# Altium project ValenFanController.PrjPCB
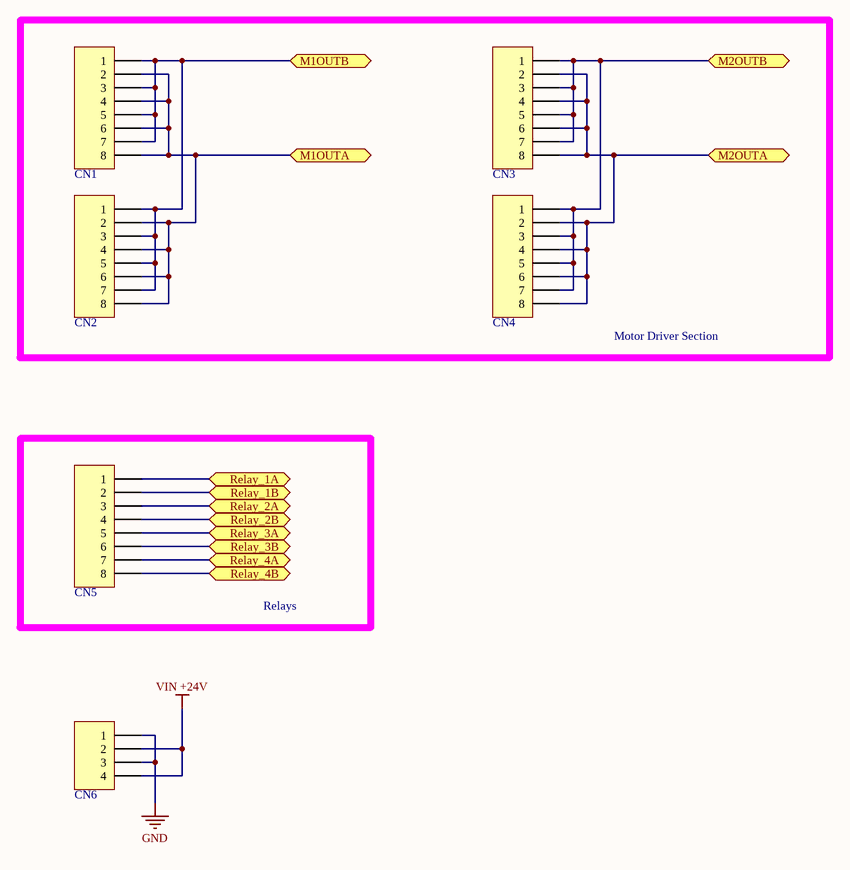
[diagram p0: Connectors.SchDoc]
7 sheets, 103 parts. Net scope: flat (ports and power ports of the same name join across sheets).
Board files: ValenFanControllerv02.PcbDoc, ValenFanControllerPanel.PcbDoc
Sheets:
  Connectors.SchDoc
  IO.SchDoc
  Main.SchDoc
  POWER.SchDoc
  Sensor.SchDoc
  USART.SchDoc
  MotorController.SchDoc

## Sheet Connectors.SchDoc
size A

### Parts
CN1  Connector 4973-08TRNLF  [Connector 4973-08TRNLF]  (value not drawn)
CN2  Connector 4973-08TRNLF  [Connector 4973-08TRNLF]  (value not drawn)
CN3  Connector 4973-08TRNLF  [Connector 4973-08TRNLF]  (value not drawn)
CN4  Connector 4973-08TRNLF  [Connector 4973-08TRNLF]  (value not drawn)
CN5  Connector 4973-08TRNLF  [Connector 4973-08TRNLF]  (value not drawn)
CN6  Connector 4973-04TRNLF  [Connector 4973-04TRNLF]  (value not drawn)

### Blocks framed on the sheet
Motor Driver Section: CN1-CN4
Relays: CN5

### Ports
M1OUTA, M1OUTB, M2OUTA, M2OUTB, Relay_1A (bidir), Relay_1B (bidir), Relay_2A (bidir), Relay_2B (bidir), Relay_3A (bidir), Relay_3B (bidir), Relay_4A (bidir), Relay_4B (bidir)

### Nets
GND: CN6.1 CN6.3
VIN +24V: CN6.2 CN6.4
NetCN1_1: CN1.1 CN1.3 CN1.5 CN1.7 CN2.1 CN2.3 CN2.5 CN2.7 ; port M1OUTB
NetCN1_2: CN1.2 CN1.4 CN1.6 CN1.8 CN2.2 CN2.4 CN2.6 CN2.8 ; port M1OUTA
NetCN3_1: CN3.1 CN3.3 CN3.5 CN3.7 CN4.1 CN4.3 CN4.5 CN4.7 ; port M2OUTB
NetCN3_2: CN3.2 CN3.4 CN3.6 CN3.8 CN4.2 CN4.4 CN4.6 CN4.8 ; port M2OUTA
NetCN5_1: CN5.1 ; port Relay_1A
NetCN5_2: CN5.2 ; port Relay_1B
NetCN5_3: CN5.3 ; port Relay_2A
NetCN5_4: CN5.4 ; port Relay_2B
NetCN5_5: CN5.5 ; port Relay_3A
NetCN5_6: CN5.6 ; port Relay_3B
NetCN5_7: CN5.7 ; port Relay_4A
NetCN5_8: CN5.8 ; port Relay_4B

### Library data of the parts
CN1-CN5 = Connector 4973-08TRNLF: Connector 8-Pin, 90 degree, 3.5mm
CN6 = Connector 4973-04TRNLF: Connector 4-Pin, 90 degree, 3.5mm

## Sheet IO.SchDoc
size C
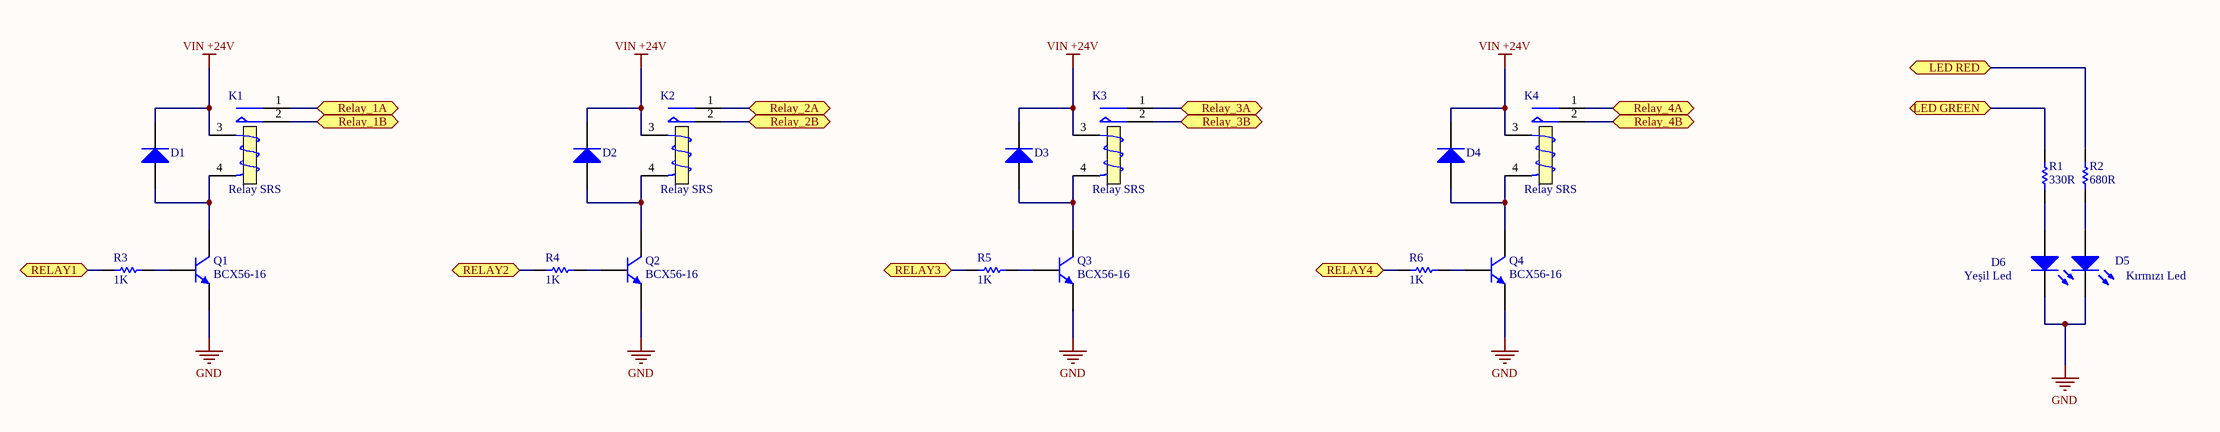
[diagram p1: IO.SchDoc]

### Parts
D1  Diode 1N4007  [DO214]  (value not drawn)
D2  Diode 1N4007  [DO214]  (value not drawn)
D3  Diode 1N4007  [DO214]  (value not drawn)
D4  Diode 1N4007  [DO214]  (value not drawn)
D5  Yeşil Led  [6-0805 - LED]
D6  Kırmızı Led  [6-0805 - LED]
K1  Relay SRS  [RELAY ALQ324]
K2  Relay SRS  [RELAY ALQ324]
K3  Relay SRS  [RELAY ALQ324]
K4  Relay SRS  [RELAY ALQ324]
Q1  BCX56-16  [SOT89M]
Q2  BCX56-16  [SOT89M]
Q3  BCX56-16  [SOT89M]
Q4  BCX56-16  [SOT89M]
R1  value 330R  [6-0805 - big]  (hidden comment: Res1)
R2  value 680R  [6-0805 - big]  (hidden comment: Res1)
R3  value 1K  [6-0805]  (hidden comment: Res1)
R4  value 1K  [6-0805]  (hidden comment: Res1)
R5  value 1K  [6-0805]  (hidden comment: Res1)
R6  value 1K  [6-0805]  (hidden comment: Res1)

### Ports
LED GREEN (bidir), LED RED (bidir), RELAY1 (bidir), RELAY2 (bidir), RELAY3 (bidir), RELAY4 (bidir), Relay_1A (bidir), Relay_1B (bidir), Relay_2A (bidir), Relay_2B (bidir), Relay_3A (bidir), Relay_3B (bidir), Relay_4A (bidir), Relay_4B (bidir)

### Nets
GND: D5.2(K) D6.2(K) Q1.3(E) Q2.3(E) Q3.3(E) Q4.3(E)
VIN +24V: D1.2(K) D2.2(K) D3.2(K) D4.2(K) K1.3(T1) K2.3(T1) K3.3(T1) K4.3(T1)
NetCN5_1: K1.1(COM) ; port Relay_1A
NetCN5_2: K1.2(NC) ; port Relay_1B
NetCN5_3: K2.1(COM) ; port Relay_2A
NetCN5_4: K2.2(NC) ; port Relay_2B
NetCN5_5: K3.1(COM) ; port Relay_3A
NetCN5_6: K3.2(NC) ; port Relay_3B
NetCN5_7: K4.1(COM) ; port Relay_4A
NetCN5_8: K4.2(NC) ; port Relay_4B
NetD1_1: D1.1(A) K1.4(T2) Q1.2(C)
NetD2_1: D2.1(A) K2.4(T2) Q2.2(C)
NetD3_1: D3.1(A) K3.4(T2) Q3.2(C)
NetD4_1: D4.1(A) K4.4(T2) Q4.2(C)
NetD5_1: D5.1(A) R2.1
NetD6_1: D6.1(A) R1.1
NetQ1_1: Q1.1(B) R3.2
NetQ2_1: Q2.1(B) R4.2
NetQ3_1: Q3.1(B) R5.2
NetQ4_1: Q4.1(B) R6.2
NetR1_2: R1.2 ; port LED GREEN
NetR2_2: R2.2 ; port LED RED
NetR3_1: R3.1 ; port RELAY1
NetR4_1: R4.1 ; port RELAY2
NetR5_1: R5.1 ; port RELAY3
NetR6_1: R6.1 ; port RELAY4

### Library data of the parts
D1-D4 = Diode 1N4007: 1 Amp General Purpose Rectifier; Published: 8-Jun-2000; LatestRevisionDate: 17-Jul-2002; LatestRevisionNote: Re-released for DXP Platform.; DatasheetDocument: 1998; PackageDocument: Aug-1999; PackageReference: DO-41; Publisher: Altium Limited; Code_JEDEC: DO-204-AL; ComponentLink1Description: Manufacturer Link; ComponentLink1URL: http://www.fairchildsemi.com/; ComponentLink2Description: Datasheet; ComponentLink2URL: http://www.fairchildsemi.com/ds/1N%2F1N4001.pdf
D5 D6 = LED: Typical INFRARED GaAs LED; Published: 8-Jun-2000; LatestRevisionDate: 08-Jul-2005; LatestRevisionNote: Mech Layer 1 removed.; PackageReference: LED-0; Publisher: Altium Limited
K1-K4 = Relay ALQ324: Published: 8-Jun-2000; Revision: July-2002: Re-released for DXP Platform.; Publisher: Altium Limited
Q1-Q4 = BCX56-16: NPN General-purpose Transistor; Published: 17-Sep-2003; LatestRevisionDate: 12-Dec-2006; LatestRevisionNote: IPC-7351 Footprint Added.; DatasheetVersion: Jun-1999; PackageVersion: May-1999; PackageReference: SOT23; Publisher: Altium Limited; PackageDescription: 3-Pin SOT-23 Package 0.95 mm Pitch, 2.3 mm Lead Span; ComponentLink1Description: Manufacturer Link; ComponentLink1URL: http://www.semiconductors.philips.com/; ComponentLink2Description: Datasheet; ComponentLink2URL: http://www.semiconductors.philips.com/acrobat/datasheets/BC817_BC817W_BC337_5.pdf
R1-R6 = Res1: Resistor; Published: 8-Jun-2000; LatestRevisionDate: 17-Jul-2002; LatestRevisionNote: Re-released for DXP Platform.; PackageReference: AXIAL-0.3; Publisher: Altium Limited

## Sheet Main.SchDoc
size A4
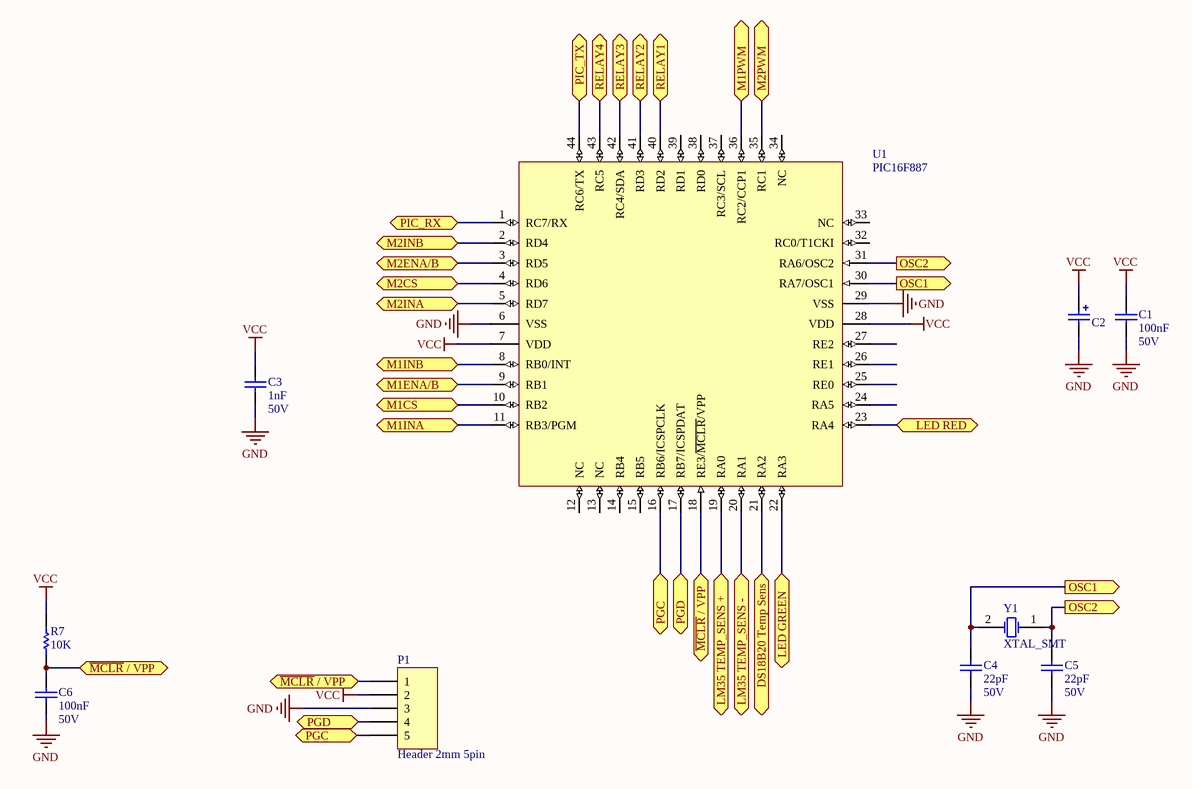
[diagram p2: Main.SchDoc]

### Parts
C1  value 100nF  Voltage: 50V  [3-0603_L]  (hidden comment: Cap)
C2  CAP-Tantal  [3528]  (value not drawn)
C3  value 1nF  Voltage: 50V  [3-0603_L]  (hidden comment: Cap)
C4  value 22pF  Voltage: 50V  [3-0603_L]  (hidden comment: Cap)
C5  value 22pF  Voltage: 50V  [3-0603_L]  (hidden comment: Cap)
C6  value 100nF  Voltage: 50V  [3-0603_L]  (hidden comment: Cap)
P1  Header 2mm 5pin  [Header 2mm 5Pin]
R7  value 10K  [3-0603_L]  (hidden comment: Res1)
U1  PIC16F887  [TQFP-44]
Y1  XTAL_SMT  [XTAL - SMT]

### Ports
DS18B20 Temp Sens (bidir), LED GREEN (bidir), LED RED (bidir), LM35 TEMP_SENS + (bidir), LM35 TEMP_SENS - (bidir), M1CS, M1ENA/B, M1INA, M1INB, M1PWM, M2CS, M2ENA/B, M2INA, M2INB, M2PWM, OSC1 (out), OSC2 (out), PGC (bidir), PGD (bidir), PIC_RX (bidir), PIC_TX (bidir), RELAY1 (bidir), RELAY2 (bidir), RELAY3 (bidir), RELAY4 (bidir), ~{MCLR} / VPP (bidir)

### Nets
GND: C1.1 C2.2 C3.1 C4.1 C5.1 C6.1 P1.3 U1.6(VSS) U1.29(VSS)
VCC: C1.2 C2.1 C3.2 P1.2 R7.2 U1.7(VDD) U1.28(VDD)
NetC4_2: C4.2 U1.30(RA7/OSC1) Y1.2(OSC2) ; port OSC1
NetC5_2: C5.2 U1.31(RA6/OSC2) Y1.1(OSC1) ; port OSC2
NetC6_2: C6.2 P1.1 R7.1 U1.18(RE3/~{MCLR}/VPP) ; port ~{MCLR} / VPP
NetC15_2: U1.10(RB2) ; port M1CS
NetC16_2: U1.4(RD6) ; port M2CS
NetD16_1: U1.20(RA1) ; port LM35 TEMP_SENS -
NetP1_4: P1.4 U1.17(RB7/ICSPDAT) ; port PGD
NetP1_5: P1.5 U1.16(RB6/ICSPCLK) ; port PGC
NetP2_2: U1.19(RA0) ; port LM35 TEMP_SENS +
NetR1_2: U1.22(RA3) ; port LED GREEN
NetR2_2: U1.23(RA4) ; port LED RED
NetR3_1: U1.40(RD2) ; port RELAY1
NetR4_1: U1.41(RD3) ; port RELAY2
NetR5_1: U1.42(RC4/SDA) ; port RELAY3
NetR6_1: U1.43(RC5) ; port RELAY4
NetR11_1: U1.9(RB1) ; port M1ENA/B
NetR12_1: U1.3(RD5) ; port M2ENA/B
NetR13_1: U1.11(RB3/PGM) ; port M1INA
NetR14_1: U1.5(RD7) ; port M2INA
NetR15_1: U1.8(RB0/INT) ; port M1INB
NetR16_1: U1.2(RD4) ; port M2INB
NetR17_1: U1.36(RC2/CCP1) ; port M1PWM
NetR18_1: U1.35(RC1) ; port M2PWM
NetR30_1: U1.21(RA2) ; port DS18B20 Temp Sens
NetU1_1: U1.1(RC7/RX) ; port PIC_RX
NetU1_44: U1.44(RC6/TX) ; port PIC_TX

Not connected (* = marked no-connect by the designer): U1 12(NC) 13(NC) 14(RB4) 15(RB5) 24(RA5) 25(RE0) 26(RE1) 27(RE2) 32(RC0/T1CKI) 33(NC) 34(NC) 37(RC3/SCL) 38(RD0) 39(RD1)

### Library data of the parts
C1 C3-C6 = Cap: Capacitor; Published: 8-Jun-2000; Revision: July-2002: Re-released for DXP Platform.; Publisher: Altium Limited
C2 = CAP-Tantal: Tantamount Military, Surface Mount MIL-PRF-55365/8 Qualified Solid Tantalum Chip Capacitor: 6.8uF, 20% Tolerance, 6 WVDC @ +85°C, Surge = 8V; Note: See Data Sheet for full range of components; Value: 22uF; Voltage: 10V; Published: 19-Mar-2004; DatasheetDocument: 20-Mar-2003; PackageReference: 3528; Publisher: Altium Limited; Code_JEITA: 3528; ComponentLink1Description: Manufacturer Link; ComponentLink1URL: http://www.vishay.com/; ComponentLink2Description: Datasheet; ComponentLink2URL: http://www.vishay.com/docs/40011/cwr11.pdf
P1 = Header 2mm 5pin: Header 2mm , 5-Pin; LatestRevisionDate: 17-Jul-2002; LatestRevisionNote: Re-released for DXP Platform.; Publisher: Altium Limited
R7 = Res1: Resistor; Published: 8-Jun-2000; LatestRevisionDate: 17-Jul-2002; LatestRevisionNote: Re-released for DXP Platform.; PackageReference: AXIAL-0.3; Publisher: Altium Limited
U1 = PIC16F887: EPROM-Based 8-Bit CMOS Microcontroller; Package Information: Latest Revision: 1998; Published: 8-Jun-2000; Revision: 17-Jul-2002: Re-released for DXP Platform.; Datasheet: Latest Revision: 1998; Package Reference: JW18; Publisher: Altium Limited
Y1 = XTAL_SMT: Crystal Oscillator; Value: 20MHz; Published: 8-Jun-2000; LatestRevisionDate: 17-Jul-2002; LatestRevisionNote: Re-released for DXP Platform.; PackageReference: R38; Publisher: Altium Limited

## Sheet POWER.SchDoc
size A4
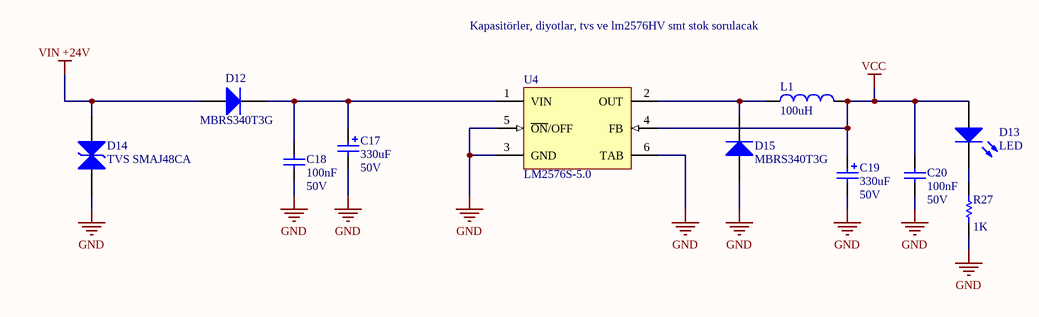
[diagram p3: POWER.SchDoc]

### Parts
C17  value 330uF  Voltage: 50V  [CAP Size H13= 12.5x13.8mm]  (hidden comment: Cap Pol1)
C18  value 100nF  Voltage: 50V  [3-0603_L]  (hidden comment: Cap)
C19  value 330uF  Voltage: 50V  [CAP Size H13= 12.5x13.8mm]  (hidden comment: Cap Pol1)
C20  value 100nF  Voltage: 50V  [3-0603_L]  (hidden comment: Cap)
D12  MBRS340T3G  [CASE 403-03 ISSUE E]
D13  LED  [6-0805 - LED]
D14  TVS SMAJ48CA  [DO214 AA]
D15  MBRS340T3G  [CASE 403-03 ISSUE E]
L1  value 100uH  [EB-221M18G01]  (hidden comment: Inductor)
R27  value 1K  [6-0805_M]  (hidden comment: Res1)
U4  LM2576S-5.0  [TS5B_M]

### Nets
GND: C17.2 C18.1 C19.2 C20.1 D14.1 D15.1(A) R27.1 U4.3(GND) U4.5(~{ON}/OFF) U4.6(TAB)
VCC: C19.1 C20.2 D13.1(A) L1.2 U4.4(FB)
VIN +24V: D12.1(A) D14.2
NetC17_1: C17.1 C18.2 D12.2(K) U4.1(VIN)
NetD13_2: D13.2(K) R27.2
NetD15_2: D15.2(K) L1.1 U4.2(OUT)

### Notes on the sheet
- Kapasitörler, diyotlar, tvs ve lm2576HV smt stok sorulacak

### Library data of the parts
C17 C19 = Cap Pol1: Polarized Capacitor (Radial); Published: 8-Jun-2000; Revision: July-2002: Re-released for DXP Platform.; Publisher: Altium Limited
C18 C20 = Cap: Capacitor; Published: 8-Jun-2000; Revision: July-2002: Re-released for DXP Platform.; Publisher: Altium Limited
D12 D15 = MBRS340T3G: 3 Amp Shotky Rectifier; Published: 8-Jun-2000; LatestRevisionDate: 17-Jul-2002; LatestRevisionNote: Re-released for DXP Platform.; DatasheetDocument: 1998; PackageDocument: Aug-1999; Publisher: Altium Limited; ComponentLink1Description: Manufacturer Link; ComponentLink2Description: Datasheet
D13 = LED: Typical INFRARED GaAs LED; Published: 8-Jun-2000; LatestRevisionDate: 08-Jul-2005; LatestRevisionNote: Mech Layer 1 removed.; PackageReference: LED-0; Publisher: Altium Limited
L1 = Inductor: Code_IEC: 1005; Published: 8-Jun-2000; LatestRevisionDate: 17-Jul-2002; LatestRevisionNote: Re-released for DXP Platform.; PackageReference: 0402-A; Publisher: Altium Limited; Code_JEITA: 0402
R27 = Res1: Resistor; Published: 8-Jun-2000; LatestRevisionDate: 17-Jul-2002; LatestRevisionNote: Re-released for DXP Platform.; PackageReference: AXIAL-0.3; Publisher: Altium Limited
U4 = LM2576S-5.0: SIMPLE SWITCHER; 3A Step-Down Voltage Regulator; Manufacturer: National Semiconductor; PackageTopMarking: NSUZXYTT*LM2576S*-5.0 P+; Published: 4-Dec-2008; PackageVersion: revD, Apr-2005; PackageReference: TS5B; Publisher: Altium Limited; PackageDescription: TO-263, Molded, .400 x .390 x .180in, 5 Lead, .067in Pitch, Surface Mount; CompType: Switcher; PartNumber: LM2576S-5.0; RoHS: O; PinCount: 5; DigiKeyPartNumber: LM2576S-5.0-ND; Code_JEDEC: MO-169-AB; ComponentLink1Description: LM2576 Datasheet; ComponentLink1URL: http://www.national.com/ds/LM/LM2576.pdf; ComponentLink2Description: LM2576 Web Page; ComponentLink2URL: http://www.national.com/pf/LM/LM2576.html; ComponentLink3Description: TS5B Package Page; ComponentLink3URL: http://www.national.com/packaging/folders/ts5b.html
D14 = TVS SMAJ48CA: Published: 8-Jun-2000; LatestRevisionDate: 17-Jul-2002; LatestRevisionNote: Re-released for DXP Platform.; DatasheetDocument: 1998; PackageDocument: Aug-1999; PackageReference: DO-41; Publisher: Altium Limited; Code_JEDEC: DO-204-AL; ComponentLink1Description: Manufacturer Link; ComponentLink1URL: http://www.fairchildsemi.com/; ComponentLink2Description: Datasheet; ComponentLink2URL: http://www.fairchildsemi.com/ds/1N%2F1N4001.pdf

## Sheet Sensor.SchDoc
size A4
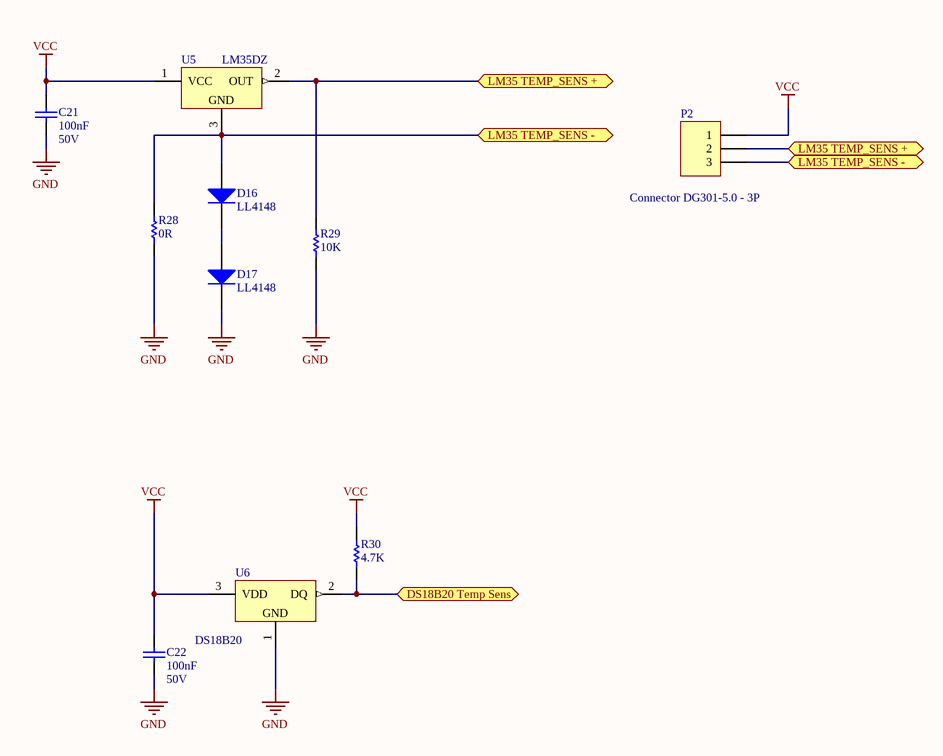
[diagram p4: Sensor.SchDoc]

### Parts
C21  value 100nF  Voltage: 50V  [3-0603_L]  (hidden comment: Cap)
C22  value 100nF  Voltage: 50V  [3-0603_L]  (hidden comment: Cap)
D16  LL4148  [DL-35 - S]
D17  LL4148  [DL-35 - S]
P2  Connector DG301-5.0 - 3P  [Connector DG301-5.0 - 3P]
R28  value 0R  [8-1206]  (hidden comment: Res1)
R29  value 10K  [3-0603_L]  (hidden comment: Res1)
R30  value 4.7K  [3-0603_L]  (hidden comment: Res1)
U5  LM35DZ  [TO-92 Big]
U6  DS18B20  [TO-92 Big]

### Ports
DS18B20 Temp Sens (bidir), LM35 TEMP_SENS + (bidir), LM35 TEMP_SENS - (bidir)

### Nets
GND: C21.1 C22.1 D17.2(K) R28.1 R29.1 U6.1(GND)
VCC: C21.2 C22.2 P2.1 R30.2 U5.1(VCC) U6.3(VDD)
NetD16_1: D16.1(A) P2.3 R28.2 U5.3(GND) ; port LM35 TEMP_SENS -
NetD16_2: D16.2(K) D17.1(A)
NetP2_2: P2.2 R29.2 U5.2(OUT) ; port LM35 TEMP_SENS +
NetR30_1: R30.1 U6.2(DQ) ; port DS18B20 Temp Sens

### Library data of the parts
C21 C22 = Cap: Capacitor; Published: 8-Jun-2000; Revision: July-2002: Re-released for DXP Platform.; Publisher: Altium Limited
D16 D17 = LL4148: 1 Amp General Purpose Rectifier; Published: 8-Jun-2000; LatestRevisionDate: 17-Jul-2002; LatestRevisionNote: Re-released for DXP Platform.; DatasheetDocument: 1998; PackageDocument: Aug-1999; Publisher: Altium Limited; Code_JEDEC: DO-204-AL; ComponentLink1Description: Manufacturer Link; ComponentLink1URL: http://www.fairchildsemi.com/; ComponentLink2Description: Datasheet; ComponentLink2URL: http://www.fairchildsemi.com/ds/1N%2F1N4001.pdf
P2 = Connector DG301-5.0 - 3P: Connector, 3-Pin; LatestRevisionDate: 17-Jul-2002; LatestRevisionNote: Re-released for DXP Platform.; Publisher: Altium Limited
R28-R30 = Res1: Resistor; Published: 8-Jun-2000; LatestRevisionDate: 17-Jul-2002; LatestRevisionNote: Re-released for DXP Platform.; PackageReference: AXIAL-0.3; Publisher: Altium Limited
U5 = LM35DZ: Temperature Sensor; Published: 24-Aug-2001; LatestRevisionDate: 06-Jun-2005; LatestRevisionNote: PCB pads lengthened.; DatasheetVersion: Mar-1997; PackageVersion: Jun-2004; PackageReference: TO-252; Publisher: Altium Limited; PackageDescription: D-PAK/TO-252-AA; 3 Leads (1 Cropped); Body 10.1 (inc. leads) x 6.6 mm (LxW max); ComponentLink1Description: Manufacturer Link; ComponentLink1URL: http://www.st.com/; ComponentLink2Description: Datasheet; ComponentLink2URL: http://www.st.com/stonline/products/literature/ds/2147/l78m05ab.pdf
U6 = DS18B20: 1-Wire Temperature Sensor; Published: 24-Aug-2001; LatestRevisionDate: 06-Jun-2005; LatestRevisionNote: PCB pads lengthened.; DatasheetVersion: Mar-1997; PackageVersion: Jun-2004; PackageReference: TO-252; Publisher: Altium Limited; PackageDescription: D-PAK/TO-252-AA; 3 Leads (1 Cropped); Body 10.1 (inc. leads) x 6.6 mm (LxW max); ComponentLink1Description: Manufacturer Link; ComponentLink1URL: http://www.st.com/; ComponentLink2Description: Datasheet; ComponentLink2URL: http://www.st.com/stonline/products/literature/ds/2147/l78m05ab.pdf

## Sheet USART.SchDoc
size A4
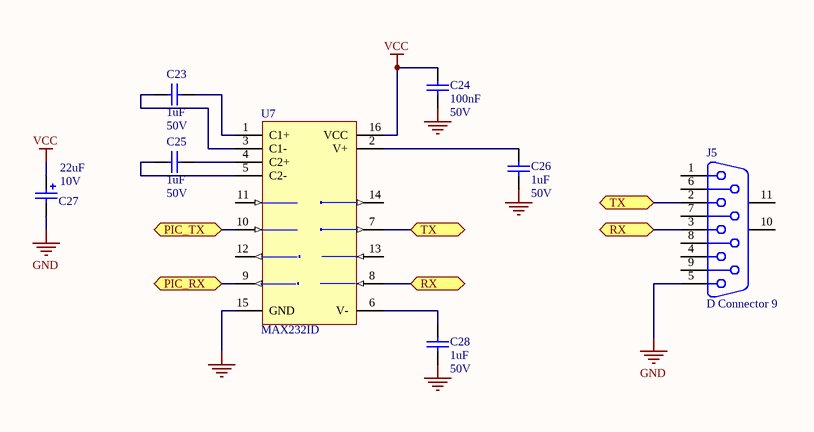
[diagram p5: USART.SchDoc]

### Parts
C23  value 1uF  Voltage: 50V  [3-0603_L]  (hidden comment: Cap)
C24  value 100nF  Voltage: 50V  [3-0603_L]  (hidden comment: Cap)
C25  value 1uF  Voltage: 50V  [3-0603_L]  (hidden comment: Cap)
C26  value 1uF  Voltage: 50V  [3-0603_L]  (hidden comment: Cap)
C27  value 22uF  Voltage: 10V  [3528]  (hidden comment: CAP-Tantal)
C28  value 1uF  Voltage: 50V  [3-0603_L]  (hidden comment: Cap)
J5  D Connector 9  [DSUB1.385-2H9]
U7  MAX232ID  [SOIC16 - big]

### Ports
PIC_RX (bidir), PIC_TX (bidir), RX (bidir), TX (bidir)

### Nets
GND: C24.1 C26.2 C27.2 C28.2 J5.5 U7.15(GND)
VCC: C24.2 C27.1 U7.16(VCC)
NetC23_1: C23.1 U7.1(C1+)
NetC23_2: C23.2 U7.3(C1-)
NetC25_1: C25.1 U7.4(C2+)
NetC25_2: C25.2 U7.5(C2-)
NetC26_1: C26.1 U7.2(V+)
NetC28_1: C28.1 U7.6(V-)
NetJ5_2: J5.2 U7.7(T2OUT) ; port TX
NetJ5_3: J5.3 U7.8(R2IN) ; port RX
NetU1_1: U7.9(R2OUT) ; port PIC_RX
NetU1_44: U7.10(T2IN) ; port PIC_TX

Not connected (* = marked no-connect by the designer): J5 1 4 6 7 8 9 10(MH1) 11(MH2); U7 11(T1IN) 12(R1OUT) 13(R1IN) 14(T1OUT)

### Library data of the parts
C23-C26 C28 = Cap: Capacitor; Published: 8-Jun-2000; Revision: July-2002: Re-released for DXP Platform.; Publisher: Altium Limited
C27 = CAP-Tantal: Tantamount Military, Surface Mount MIL-PRF-55365/8 Qualified Solid Tantalum Chip Capacitor: 6.8uF, 20% Tolerance, 6 WVDC @ +85°C, Surge = 8V; Note: See Data Sheet for full range of components; Published: 19-Mar-2004; DatasheetDocument: 20-Mar-2003; PackageReference: 3528; Publisher: Altium Limited; Code_JEITA: 3528; ComponentLink1Description: Manufacturer Link; ComponentLink1URL: http://www.vishay.com/; ComponentLink2Description: Datasheet; ComponentLink2URL: http://www.vishay.com/docs/40011/cwr11.pdf
J5 = D Connector 9: Receptacle Assembly, 9 Position, Right Angle; PackageDocument: O; Positions: 9; Published: 15-Jun-2001; LatestRevisionDate: 17-Jul-2002; LatestRevisionNote: Re-released for DXP Platform.; DatasheetDocument: 1-Sep-1999; PackageReference: 788750; Publisher: Altium Limited; Orientation: Right Angle; Gender: Receptacle
U7 = MAX232ID: 5V, Low-Power, up to 1Mbps, True RS-232 Transceiver Using Four 0.1µF External Capacitor; Code - JEDEC: MS-012-AC; Code - IPC: SO16; Published: 16-Jan-2001; Revision: 17-Jul-2002: Re-released for DXP Platform.; Datasheet: Latest Revision: Mar-1999; Package Reference: NSO16; Publisher: Altium Limited

## Sheet MotorController.SchDoc
size A3
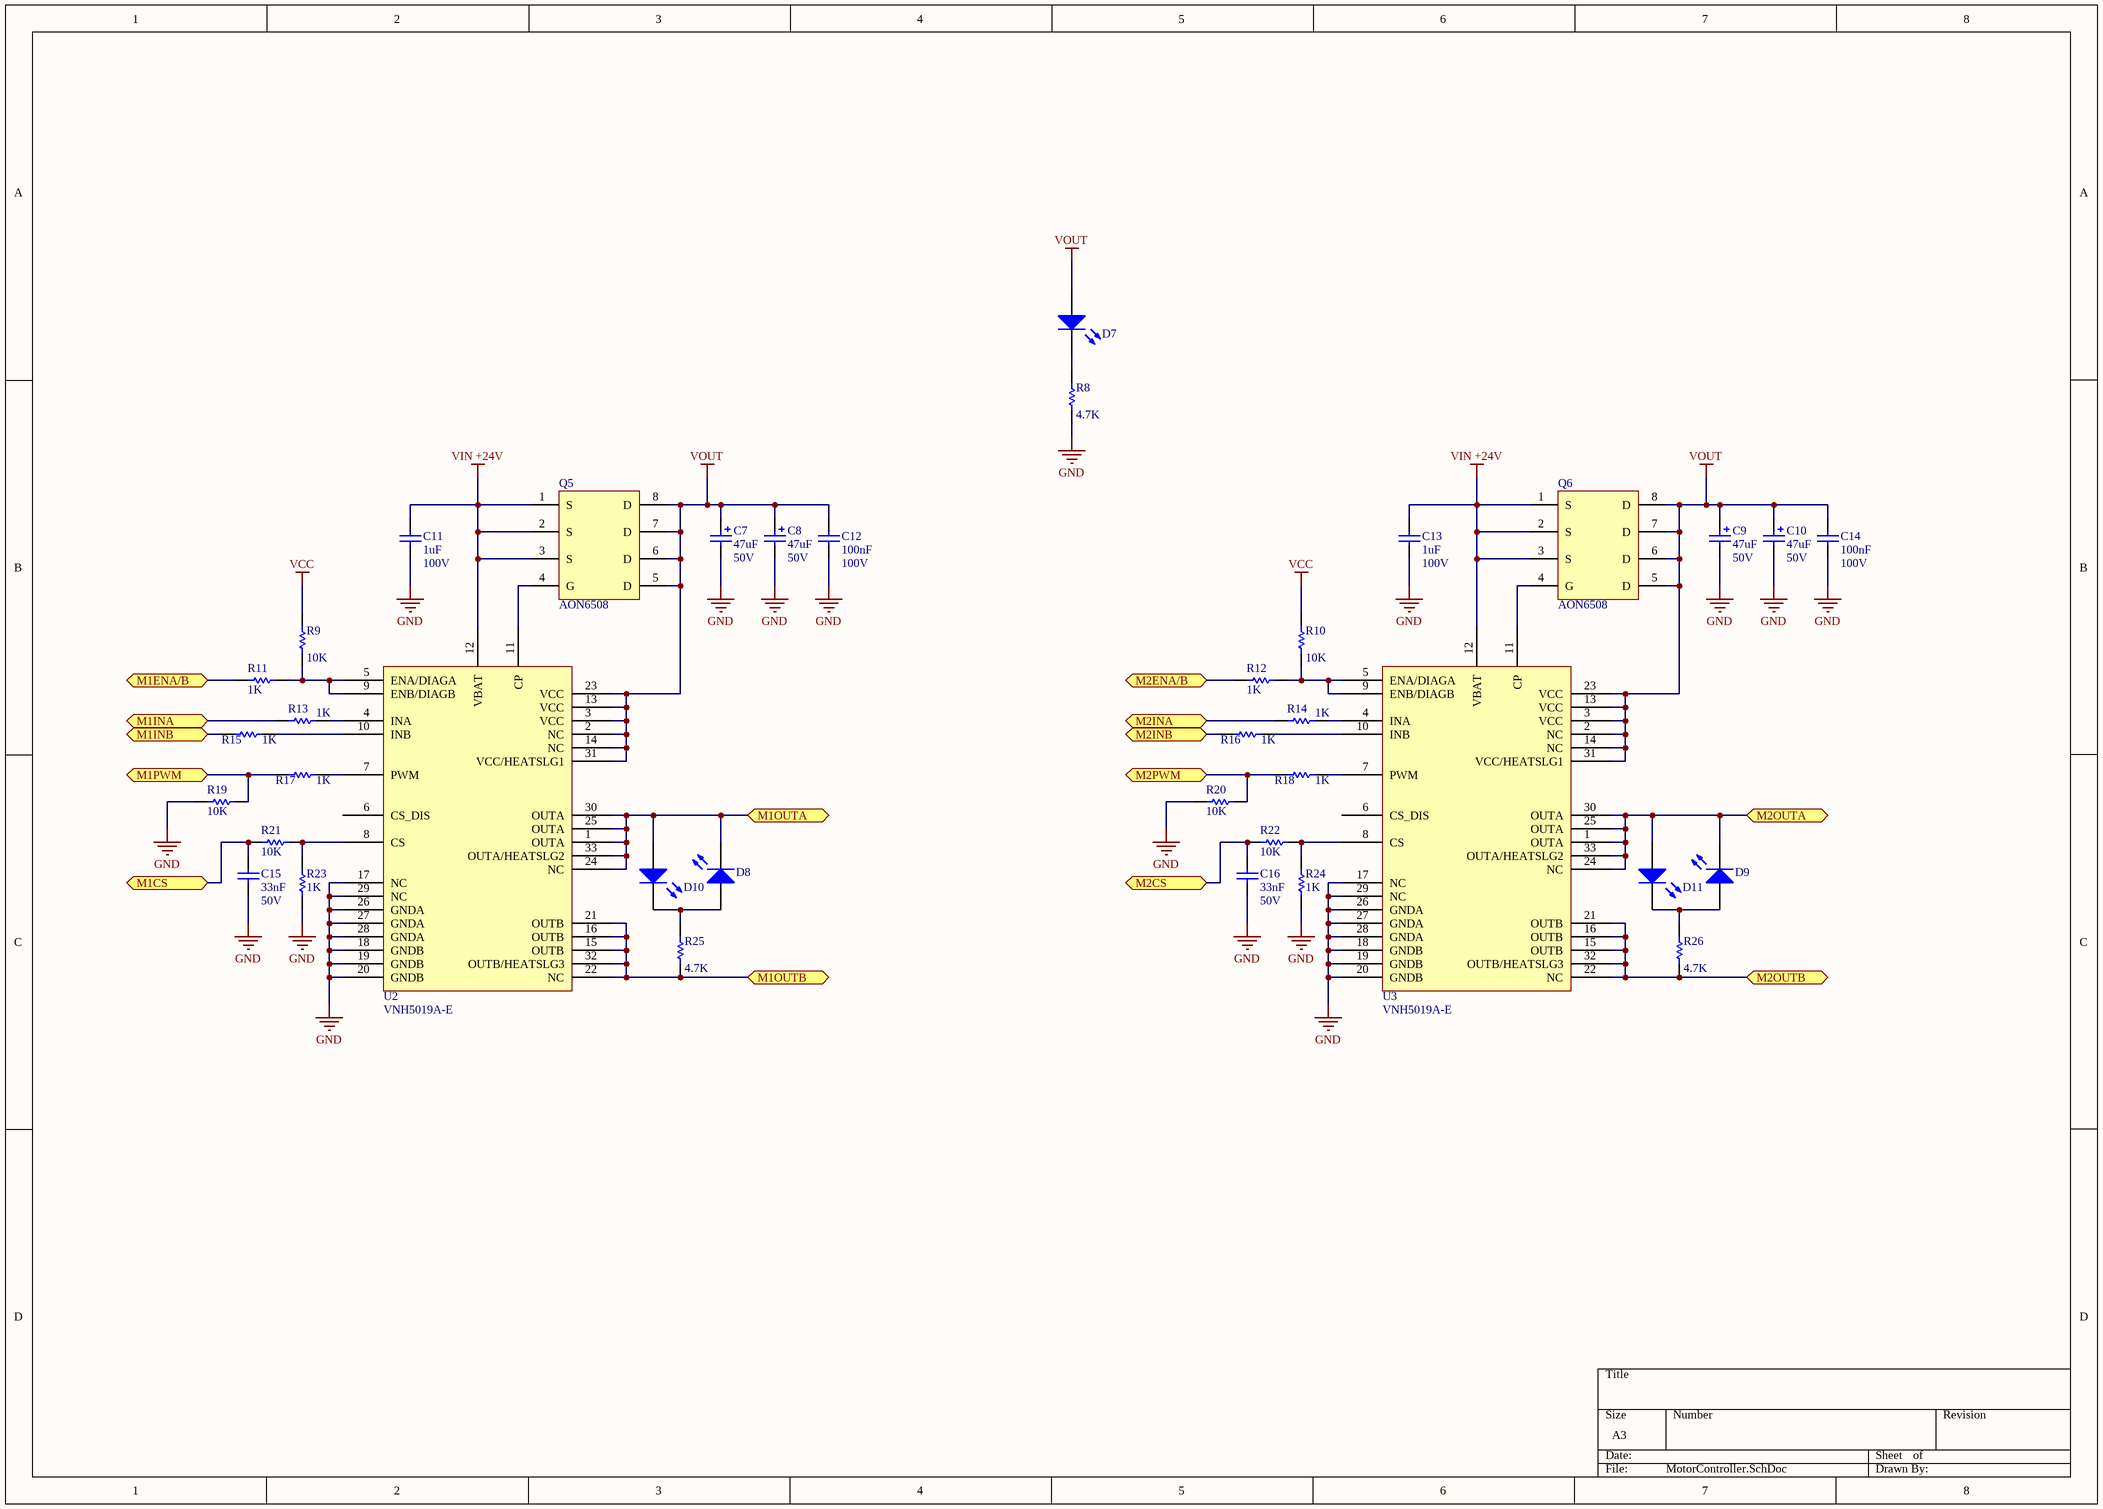
[diagram p6: MotorController.SchDoc]

### Parts
C7  value 47uF  Voltage: 50V  [CAP D Size]  (hidden comment: Cap Pol1)
C8  value 47uF  Voltage: 50V  [CAP D Size]  (hidden comment: Cap Pol1)
C9  value 47uF  Voltage: 50V  [CAP D Size]  (hidden comment: Cap Pol1)
C10  value 47uF  Voltage: 50V  [CAP D Size]  (hidden comment: Cap Pol1)
C11  value 1uF  Voltage: 100V  [8-1206]  (hidden comment: Cap)
C12  value 100nF  Voltage: 100V  [6-0805 - big]  (hidden comment: Cap)
C13  value 1uF  Voltage: 100V  [8-1206]  (hidden comment: Cap)
C14  value 100nF  Voltage: 100V  [6-0805 - big]  (hidden comment: Cap)
C15  value 33nF  Voltage: 50V  [3-0603_L]  (hidden comment: Cap)
C16  value 33nF  Voltage: 50V  [3-0603_L]  (hidden comment: Cap)
D7  LED  [6-0805 - LED]  (value not drawn)
D8  LED  [6-0805 - LED]  (value not drawn)
D9  LED  [6-0805 - LED]  (value not drawn)
D10  LED  [6-0805 - LED]  (value not drawn)
D11  LED  [6-0805 - LED]  (value not drawn)
Q5  AON6508  [DFN5x6 EP]
Q6  AON6508  [DFN5x6 EP]
R8  value 4.7K  [3-0603_L]  (hidden comment: Res1)
R9  value 10K  [3-0603_L]  (hidden comment: Res1)
R10  value 10K  [3-0603_L]  (hidden comment: Res1)
R11  value 1K  [3-0603_L]  (hidden comment: Res1)
R12  value 1K  [3-0603_L]  (hidden comment: Res1)
R13  value 1K  [3-0603_L]  (hidden comment: Res1)
R14  value 1K  [3-0603_L]  (hidden comment: Res1)
R15  value 1K  [3-0603_L]  (hidden comment: Res1)
R16  value 1K  [3-0603_L]  (hidden comment: Res1)
R17  value 1K  [3-0603_L]  (hidden comment: Res1)
R18  value 1K  [3-0603_L]  (hidden comment: Res1)
R19  value 10K  [3-0603_L]  (hidden comment: Res1)
R20  value 10K  [3-0603_L]  (hidden comment: Res1)
R21  value 10K  [3-0603_L]  (hidden comment: Res1)
R22  value 10K  [3-0603_L]  (hidden comment: Res1)
R23  value 1K  [3-0603_L]  (hidden comment: Res1)
R24  value 1K  [3-0603_L]  (hidden comment: Res1)
R25  value 4.7K  [3-0603_L]  (hidden comment: Res1)
R26  value 4.7K  [3-0603_L]  (hidden comment: Res1)
U2  VNH5019A-E  [MultiPowerSO-30]
U3  VNH5019A-E  [MultiPowerSO-30]

### Ports
M1CS, M1ENA/B, M1INA, M1INB, M1OUTA, M1OUTB, M1PWM, M2CS, M2ENA/B, M2INA, M2INB, M2OUTA, M2OUTB, M2PWM

### Nets
GND: C7.2 C8.2 C9.2 C10.2 C11.1 C12.1 C13.1 C14.1 C15.1 C16.1 R8.1 R19.1 R20.1 R23.1 R24.1 U2.17(NC) U2.18(GNDB) U2.19(GNDB) U2.20(GNDB) U2.26(GNDA) U2.27(GNDA) U2.28(GNDA) U2.29(NC) U3.17(NC) U3.18(GNDB) U3.19(GNDB) U3.20(GNDB) U3.26(GNDA) U3.27(GNDA) U3.28(GNDA) U3.29(NC)
VCC: R9.2 R10.2
VIN +24V: C11.2 C13.2 Q5.1(S) Q5.2(S) Q5.3(S) Q6.1(S) Q6.2(S) Q6.3(S) U2.12(VBAT) U3.12(VBAT)
VOUT: C7.1 C8.1 C9.1 C10.1 C12.2 C14.2 D7.1(A) Q5.5(D) Q5.6(D) Q5.7(D) Q5.8(D) Q6.5(D) Q6.6(D) Q6.7(D) Q6.8(D) U2.2(NC) U2.3(VCC) U2.13(VCC) U2.14(NC) U2.23(VCC) U2.31(VCC/HEATSLG1) U3.2(NC) U3.3(VCC) U3.13(VCC) U3.14(NC) U3.23(VCC) U3.31(VCC/HEATSLG1)
NetC15_2: C15.2 R21.2 ; port M1CS
NetC16_2: C16.2 R22.2 ; port M2CS
NetCN1_1: R25.1 U2.15(OUTB) U2.16(OUTB) U2.21(OUTB) U2.22(NC) U2.32(OUTB/HEATSLG3) ; port M1OUTB
NetCN1_2: D8.2(K) D10.1(A) U2.1(OUTA) U2.24(NC) U2.25(OUTA) U2.30(OUTA) U2.33(OUTA/HEATSLG2) ; port M1OUTA
NetCN3_1: R26.1 U3.15(OUTB) U3.16(OUTB) U3.21(OUTB) U3.22(NC) U3.32(OUTB/HEATSLG3) ; port M2OUTB
NetCN3_2: D9.2(K) D11.1(A) U3.1(OUTA) U3.24(NC) U3.25(OUTA) U3.30(OUTA) U3.33(OUTA/HEATSLG2) ; port M2OUTA
NetD7_2: D7.2(K) R8.2
NetD8_1: D8.1(A) D10.2(K) R25.2
NetD9_1: D9.1(A) D11.2(K) R26.2
NetQ5_4: Q5.4(G) U2.11(CP)
NetQ6_4: Q6.4(G) U3.11(CP)
NetR9_1: R9.1 R11.2 U2.5(ENA/DIAGA) U2.9(ENB/DIAGB)
NetR10_1: R10.1 R12.2 U3.5(ENA/DIAGA) U3.9(ENB/DIAGB)
NetR11_1: R11.1 ; port M1ENA/B
NetR12_1: R12.1 ; port M2ENA/B
NetR13_1: R13.1 ; port M1INA
NetR13_2: R13.2 U2.4(INA)
NetR14_1: R14.1 ; port M2INA
NetR14_2: R14.2 U3.4(INA)
NetR15_1: R15.1 ; port M1INB
NetR15_2: R15.2 U2.10(INB)
NetR16_1: R16.1 ; port M2INB
NetR16_2: R16.2 U3.10(INB)
NetR17_1: R17.1 R19.2 ; port M1PWM
NetR17_2: R17.2 U2.7(PWM)
NetR18_1: R18.1 R20.2 ; port M2PWM
NetR18_2: R18.2 U3.7(PWM)
NetR21_1: R21.1 R23.2 U2.8(CS)
NetR22_1: R22.1 R24.2 U3.8(CS)

Not connected (* = marked no-connect by the designer): U2 6(CS_DIS); U3 6(CS_DIS)

### Library data of the parts
C7-C10 = Cap Pol1: Polarized Capacitor (Radial); Published: 8-Jun-2000; Revision: July-2002: Re-released for DXP Platform.; Publisher: Altium Limited
C11-C16 = Cap: Capacitor; Published: 8-Jun-2000; Revision: July-2002: Re-released for DXP Platform.; Publisher: Altium Limited
D7-D11 = LED: Typical INFRARED GaAs LED; Published: 8-Jun-2000; LatestRevisionDate: 08-Jul-2005; LatestRevisionNote: Mech Layer 1 removed.; PackageReference: LED-0; Publisher: Altium Limited
Q5 Q6 = AON6508: 30V N-Channel AlphaMOS; Published: 29-Jan-2009; DatasheetVersion: revE, Mar-2007; PackageVersion: revAW, Oct-2008; Publisher: Altium Limited; ComponentLink3Description: Packaging Specification
R8-R26 = Res1: Resistor; Published: 8-Jun-2000; LatestRevisionDate: 17-Jul-2002; LatestRevisionNote: Re-released for DXP Platform.; PackageReference: AXIAL-0.3; Publisher: Altium Limited
U2 U3 = VNH5019A-E: Automotive fully integrated H-bridge motor driver; PackageVersion: revAW, Oct-2008; Publisher: Altium Limited; ComponentLink2Description: Datasheet

## Nets that join several sheets
GND: Connectors (CN6.1 CN6.3), IO (6 pins), Main (9 pins), POWER (10 pins), Sensor (6 pins), USART (6 pins), MotorController (31 pins)
VCC: Main (7 pins), POWER (5 pins), Sensor (6 pins), USART (C24.2 C27.1 U7.16), MotorController (R9.2 R10.2)
VIN +24V: Connectors (CN6.2 CN6.4), IO (8 pins), POWER (D12.1 D14.2), MotorController (10 pins)
NetC15_2: Main (U1.10), MotorController (C15.2 R21.2)
NetC16_2: Main (U1.4), MotorController (C16.2 R22.2)
NetCN1_1: Connectors (8 pins), MotorController (6 pins)
NetCN1_2: Connectors (8 pins), MotorController (7 pins)
NetCN3_1: Connectors (8 pins), MotorController (6 pins)
NetCN3_2: Connectors (8 pins), MotorController (7 pins)
NetCN5_1: Connectors (CN5.1), IO (K1.1)
NetCN5_2: Connectors (CN5.2), IO (K1.2)
NetCN5_3: Connectors (CN5.3), IO (K2.1)
NetCN5_4: Connectors (CN5.4), IO (K2.2)
NetCN5_5: Connectors (CN5.5), IO (K3.1)
NetCN5_6: Connectors (CN5.6), IO (K3.2)
NetCN5_7: Connectors (CN5.7), IO (K4.1)
NetCN5_8: Connectors (CN5.8), IO (K4.2)
NetD16_1: Main (U1.20), Sensor (D16.1 P2.3 R28.2 U5.3)
NetP2_2: Main (U1.19), Sensor (P2.2 R29.2 U5.2)
NetR1_2: IO (R1.2), Main (U1.22)
NetR2_2: IO (R2.2), Main (U1.23)
NetR3_1: IO (R3.1), Main (U1.40)
NetR4_1: IO (R4.1), Main (U1.41)
NetR5_1: IO (R5.1), Main (U1.42)
NetR6_1: IO (R6.1), Main (U1.43)
NetR11_1: Main (U1.9), MotorController (R11.1)
NetR12_1: Main (U1.3), MotorController (R12.1)
NetR13_1: Main (U1.11), MotorController (R13.1)
NetR14_1: Main (U1.5), MotorController (R14.1)
NetR15_1: Main (U1.8), MotorController (R15.1)
NetR16_1: Main (U1.2), MotorController (R16.1)
NetR17_1: Main (U1.36), MotorController (R17.1 R19.2)
NetR18_1: Main (U1.35), MotorController (R18.1 R20.2)
NetR30_1: Main (U1.21), Sensor (R30.1 U6.2)
NetU1_1: Main (U1.1), USART (U7.9)
NetU1_44: Main (U1.44), USART (U7.10)